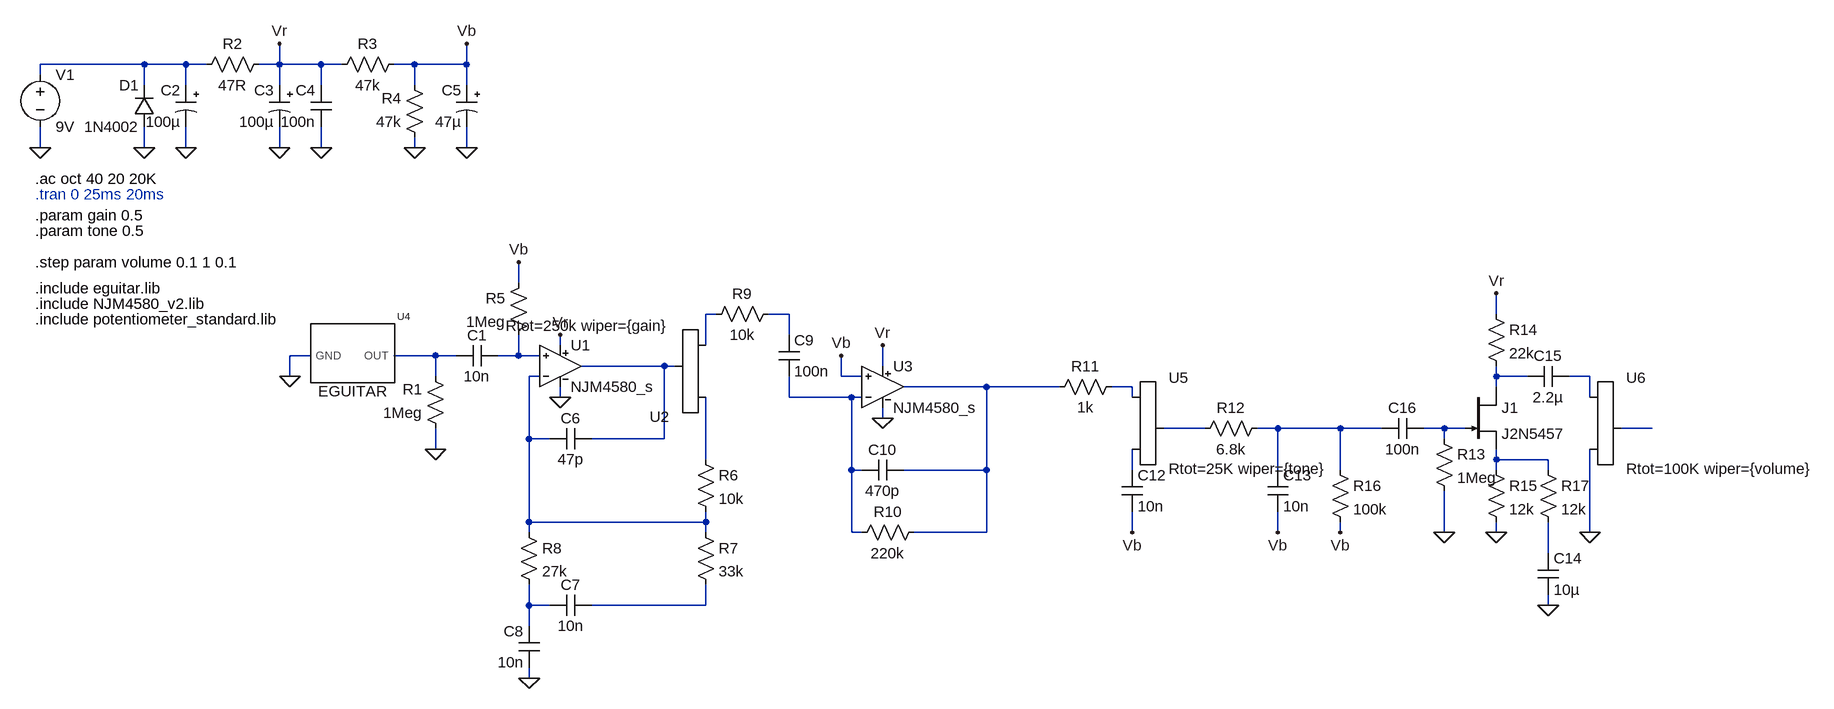
[diagram p0: schematic rcrd_brkr.asc]
rcrd_brkr.asc, the LTspice schematic file:
Version 4
SHEET 1 2032 792
WIRE -560 -304 -720 -304
WIRE -496 -304 -560 -304
WIRE -464 -304 -496 -304
WIRE -352 -304 -352 -336
WIRE -352 -304 -384 -304
WIRE -288 -304 -352 -304
WIRE -256 -304 -288 -304
WIRE -144 -304 -176 -304
WIRE -64 -304 -64 -336
WIRE -64 -304 -144 -304
WIRE -720 -288 -720 -304
WIRE -560 -272 -560 -304
WIRE -496 -272 -496 -304
WIRE -352 -272 -352 -304
WIRE -288 -272 -288 -304
WIRE -144 -272 -144 -304
WIRE -64 -272 -64 -304
WIRE -720 -176 -720 -208
WIRE -560 -176 -560 -208
WIRE -496 -176 -496 -208
WIRE -352 -176 -352 -208
WIRE -288 -176 -288 -208
WIRE -144 -176 -144 -192
WIRE -64 -176 -64 -208
WIRE 16 32 16 0
WIRE 320 80 304 80
WIRE 432 80 400 80
WIRE 1520 80 1520 48
WIRE 432 112 432 80
WIRE 80 128 80 112
WIRE 304 128 304 80
WIRE -304 144 -336 144
WIRE -112 144 -176 144
WIRE -80 144 -112 144
WIRE 16 144 16 112
WIRE 16 144 -16 144
WIRE 48 144 16 144
WIRE 240 160 112 160
WIRE 256 160 240 160
WIRE 576 160 576 128
WIRE -336 176 -336 144
WIRE -112 176 -112 144
WIRE 48 176 32 176
WIRE 512 176 512 144
WIRE 544 176 512 176
WIRE 1520 176 1520 160
WIRE 1568 176 1520 176
WIRE 1664 176 1632 176
WIRE 736 192 608 192
WIRE 848 192 736 192
WIRE 960 192 928 192
WIRE 1520 192 1520 176
WIRE 80 208 80 192
WIRE 432 208 432 176
WIRE 528 208 432 208
WIRE 544 208 528 208
WIRE 960 208 960 192
WIRE 1664 208 1664 176
WIRE 576 240 576 224
WIRE 1072 256 1008 256
WIRE 1184 256 1152 256
WIRE 1280 256 1184 256
WIRE 1344 256 1280 256
WIRE 1440 256 1408 256
WIRE 1472 256 1440 256
WIRE 1760 256 1712 256
WIRE 32 272 32 176
WIRE 64 272 32 272
WIRE 240 272 240 160
WIRE 240 272 128 272
WIRE 1440 272 1440 256
WIRE -112 288 -112 256
WIRE 304 304 304 208
WIRE 1520 304 1520 288
WIRE 1600 304 1520 304
WIRE 528 320 528 208
WIRE 544 320 528 320
WIRE 736 320 736 192
WIRE 736 320 608 320
WIRE 960 320 960 288
WIRE 1184 320 1184 256
WIRE 1280 320 1280 256
WIRE 1520 320 1520 304
WIRE 1600 320 1600 304
WIRE 32 400 32 272
WIRE 304 400 304 384
WIRE 304 400 32 400
WIRE 32 416 32 400
WIRE 304 416 304 400
WIRE 528 416 528 320
WIRE 544 416 528 416
WIRE 736 416 736 320
WIRE 736 416 624 416
WIRE 960 416 960 384
WIRE 1184 416 1184 384
WIRE 1280 416 1280 400
WIRE 1440 416 1440 352
WIRE 1520 416 1520 400
WIRE 1664 416 1664 288
WIRE 1600 448 1600 400
WIRE 32 528 32 496
WIRE 64 528 32 528
WIRE 304 528 304 496
WIRE 304 528 128 528
WIRE 1600 528 1600 512
WIRE 32 560 32 528
WIRE 32 640 32 624
FLAG -336 176 0
FLAG -112 288 0
FLAG -560 -176 0
FLAG -496 -176 0
FLAG -352 -176 0
FLAG -288 -176 0
FLAG -144 -176 0
FLAG -64 -176 0
FLAG -352 -336 Vr
FLAG -64 -336 Vb
FLAG -720 -176 0
FLAG 16 0 Vb
FLAG 80 208 0
FLAG 80 112 Vr
FLAG 32 640 0
FLAG 512 144 Vb
FLAG 576 240 0
FLAG 576 128 Vr
FLAG 1440 416 0
FLAG 1520 416 0
FLAG 1664 416 0
FLAG 1520 48 Vr
FLAG 1600 528 0
FLAG 960 416 Vb
FLAG 1184 416 Vb
FLAG 1280 416 Vb
SYMBOL eguitar -208 160 R0
SYMATTR InstName U4
SYMBOL res -96 272 R180
WINDOW 0 36 76 Left 2
WINDOW 3 36 40 Left 2
SYMATTR InstName R1
SYMATTR Value 1Meg
SYMATTR SpiceLine tol=1% pwr=0.25
SYMBOL res -368 -320 R90
WINDOW 0 0 56 VBottom 2
WINDOW 3 32 56 VTop 2
SYMATTR InstName R2
SYMATTR Value 47R
SYMATTR SpiceLine tol=1% pwr=0.25
SYMBOL polcap -480 -272 M0
SYMATTR InstName C2
SYMATTR Value 100µ
SYMATTR Description Capacitor
SYMATTR Type cap
SYMATTR SpiceLine V=16 Irms=170m Rser=1 Lser=0 mfg="Nichicon" pn="UPG1C101MPH" type="Al electrolytic"
SYMBOL diode -544 -208 R180
WINDOW 0 24 64 Left 2
WINDOW 3 24 0 Left 2
SYMATTR InstName D1
SYMATTR Value 1N4002
SYMBOL cap -272 -208 R180
WINDOW 0 24 56 Left 2
WINDOW 3 24 8 Left 2
SYMATTR InstName C4
SYMATTR Value 100n
SYMATTR SpiceLine V=50 Irms=728m Rser=0.14361 Lser=0 mfg="KEMET" pn="C0603C104K5RAC" type="X7R"
SYMBOL res -160 -320 R90
WINDOW 0 0 56 VBottom 2
WINDOW 3 32 56 VTop 2
SYMATTR InstName R3
SYMATTR Value 47k
SYMATTR SpiceLine tol=1% pwr=0.25
SYMBOL res -128 -176 R180
WINDOW 0 36 76 Left 2
WINDOW 3 36 40 Left 2
SYMATTR InstName R4
SYMATTR Value 47k
SYMATTR SpiceLine tol=1% pwr=0.25
SYMBOL polcap -48 -272 M0
WINDOW 3 24 56 Left 2
SYMATTR Value 47µ
SYMATTR InstName C5
SYMATTR Description Capacitor
SYMATTR Type cap
SYMATTR SpiceLine V=25 Irms=170m Rser=1 Lser=0 mfg="Nichicon" pn="UPG1E470MPH" type="Al electrolytic"
SYMBOL polcap -336 -272 M0
SYMATTR InstName C3
SYMATTR Value 100µ
SYMATTR Description Capacitor
SYMATTR Type cap
SYMATTR SpiceLine V=16 Irms=170m Rser=1 Lser=0 mfg="Nichicon" pn="UPG1C101MPH" type="Al electrolytic"
SYMBOL res 32 16 M0
SYMATTR InstName R5
SYMATTR Value 1Meg
SYMATTR SpiceLine tol=1% pwr=0.25
SYMBOL cap -16 128 R90
WINDOW 0 0 32 VBottom 2
WINDOW 3 32 32 VTop 2
SYMATTR InstName C1
SYMATTR Value 10n
SYMBOL potentiometer_standard 320 224 R180
SYMATTR InstName U2
SYMATTR Value Rtot=250k wiper={gain}
SYMATTR SpiceLine ""
SYMBOL voltage -720 -304 R0
WINDOW 123 0 0 Left 0
WINDOW 39 0 0 Left 0
SYMATTR InstName V1
SYMATTR Value 9V
SYMBOL NJM4580 80 96 R0
SYMATTR InstName U1
SYMBOL cap 128 256 R90
WINDOW 0 0 32 VBottom 2
WINDOW 3 32 32 VTop 2
SYMATTR InstName C6
SYMATTR Value 47p
SYMBOL res 288 288 R0
SYMATTR InstName R6
SYMATTR Value 10k
SYMBOL res 288 400 R0
SYMATTR InstName R7
SYMATTR Value 33k
SYMBOL res 16 400 R0
SYMATTR InstName R8
SYMATTR Value 27k
SYMBOL cap 128 512 R90
WINDOW 0 0 32 VBottom 2
WINDOW 3 32 32 VTop 2
SYMATTR InstName C7
SYMATTR Value 10n
SYMBOL cap 48 624 R180
WINDOW 0 24 56 Left 2
WINDOW 3 24 8 Left 2
SYMATTR InstName C8
SYMATTR Value 10n
SYMBOL res 416 64 R90
WINDOW 0 0 56 VBottom 2
WINDOW 3 32 56 VTop 2
SYMATTR InstName R9
SYMATTR Value 10k
SYMBOL cap 416 112 R0
SYMATTR InstName C9
SYMATTR Value 100n
SYMBOL NJM4580 576 128 R0
SYMATTR InstName U3
SYMBOL cap 608 304 R90
WINDOW 0 0 32 VBottom 2
WINDOW 3 32 32 VTop 2
SYMATTR InstName C10
SYMATTR Value 470p
SYMBOL res 640 400 R90
WINDOW 0 0 56 VBottom 2
WINDOW 3 32 56 VTop 2
SYMATTR InstName R10
SYMATTR Value 220k
SYMBOL res 944 176 R90
WINDOW 0 0 56 VBottom 2
WINDOW 3 32 56 VTop 2
SYMATTR InstName R11
SYMATTR Value 1k
SYMBOL potentiometer_standard 944 192 R0
SYMATTR InstName U5
SYMATTR Value Rtot=25K wiper={tone}
SYMATTR SpiceLine ""
SYMBOL cap 944 320 R0
SYMATTR InstName C12
SYMATTR Value 10n
SYMBOL res 1168 240 R90
WINDOW 0 0 56 VBottom 2
WINDOW 3 32 56 VTop 2
SYMATTR InstName R12
SYMATTR Value 6.8k
SYMBOL cap 1168 320 R0
SYMATTR InstName C13
SYMATTR Value 10n
SYMBOL res 1424 256 R0
SYMATTR InstName R13
SYMATTR Value 1Meg
SYMBOL njf 1472 192 R0
SYMATTR InstName J1
SYMATTR Value J2N5457
SYMBOL res 1504 64 R0
SYMATTR InstName R14
SYMATTR Value 22k
SYMBOL res 1504 304 R0
SYMATTR InstName R15
SYMATTR Value 12k
SYMBOL cap 1584 448 R0
SYMATTR InstName C14
SYMATTR Value 10µ
SYMBOL cap 1632 160 R90
WINDOW 0 0 32 VBottom 2
WINDOW 3 32 32 VTop 2
SYMATTR InstName C15
SYMATTR Value 2.2µ
SYMBOL potentiometer_standard 1648 192 R0
SYMATTR InstName U6
SYMATTR Value Rtot=100K wiper={volume}
SYMBOL cap 1408 240 R90
WINDOW 0 0 32 VBottom 2
WINDOW 3 32 32 VTop 2
SYMATTR InstName C16
SYMATTR Value 100n
SYMBOL res 1264 304 R0
SYMATTR InstName R16
SYMATTR Value 100k
SYMBOL res 1584 304 R0
SYMATTR InstName R17
SYMATTR Value 12k
TEXT -728 -104 Left 2 ;.tran 0 25ms 20ms
TEXT -728 40 Left 2 !.include eguitar.lib
TEXT -728 64 Left 2 !.include NJM4580_v2.lib
TEXT -728 88 Left 2 !.include potentiometer_standard.lib
TEXT -728 -72 Left 2 !.param gain 0.5
TEXT -728 -48 Left 2 !.param tone 0.5
TEXT -728 0 Left 2 !.step param volume 0.1 1 0.1
TEXT -728 -128 Left 2 !.ac oct 40 20 20K

The netlist it stands for:
* rcrd_brkr.asc
XU4 N004 0 EGUITAR  ; pins OUT GND
R1 0 N004 1Meg tol=1% pwr=0.25
R2 Vr N001 47R tol=1% pwr=0.25
C2 N001 0 100µ V=16 Irms=170m Rser=1 Lser=0 mfg="Nichicon" pn="UPG1C101MPH" type="Al electrolytic"
D1 0 N001 1N4002
C4 0 Vr 100n V=50 Irms=728m Rser=0.14361 Lser=0 mfg="KEMET" pn="C0603C104K5RAC" type="X7R"
R3 Vb Vr 47k tol=1% pwr=0.25
R4 0 Vb 47k tol=1% pwr=0.25
C5 Vb 0 47µ V=25 Irms=170m Rser=1 Lser=0 mfg="Nichicon" pn="UPG1E470MPH" type="Al electrolytic"
C3 Vr 0 100µ V=16 Irms=170m Rser=1 Lser=0 mfg="Nichicon" pn="UPG1C101MPH" type="Al electrolytic"
R5 Vb N005 1Meg tol=1% pwr=0.25
C1 N005 N004 10n
XU2 N017 N002 N006 Rtot=250k wiper={gain}
V1 N001 0 9V
XU1 N005 N007 Vr 0 N006 NJM4580_s  ; pins +IN -IN V+ V- OUT
C6 N006 N007 47p
R6 N017 N007 10k
R7 N007 N022 33k
R8 N007 N021 27k
C7 N022 N021 10n
C8 0 N021 10n
R9 N003 N002 10k
C9 N003 N012 100n
XU3 Vb N012 Vr 0 N010 NJM4580_s  ; pins +IN -IN V+ V- OUT
C10 N010 N012 470p
R10 N010 N012 220k
R11 N011 N010 1k
XU5 N011 N019 N013 Rtot=25K wiper={tone}
C12 N019 Vb 10n
R12 N014 N013 6.8k
C13 N014 Vb 10n
R13 N015 0 1Meg
J1 N008 N015 N018 J2N5457
R14 Vr N008 22k
R15 N018 0 12k
C14 N020 0 10µ
C15 N009 N008 2.2µ
XU6 N009 0 N016 Rtot=100K wiper={volume}
C16 N015 N014 100n
R16 N014 Vb 100k
R17 N018 N020 12k
.model D D
.lib standard.dio
.model NJF NJF
.model PJF PJF
.lib standard.jft
* .tran 0 25ms 20ms
.include eguitar.lib
.include NJM4580_v2.lib
.include potentiometer_standard.lib
.param gain 0.5
.param tone 0.5
.step param volume 0.1 1 0.1
.ac oct 40 20 20K
.lib eguitar.lib
.lib njm4580_v2.lib
.backanno
.end